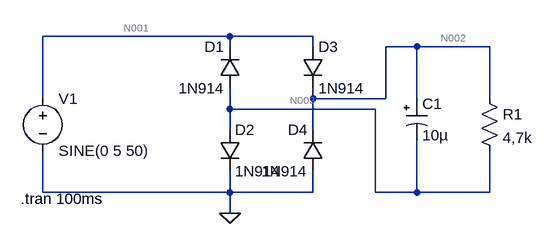
[diagram p0: schematic sim2shema.asc]
sim2shema.asc, the LTspice schematic file:
Version 4
SHEET 1 880 680
WIRE 288 64 0 64
WIRE 416 64 288 64
WIRE 288 80 288 64
WIRE 416 80 416 64
WIRE 576 80 528 80
WIRE 688 80 576 80
WIRE 0 160 0 64
WIRE 416 160 416 144
WIRE 528 160 528 80
WIRE 528 160 416 160
WIRE 576 160 576 80
WIRE 688 160 688 80
WIRE 288 176 288 144
WIRE 512 176 288 176
WIRE 288 208 288 176
WIRE 416 208 416 160
WIRE 0 304 0 240
WIRE 288 304 288 272
WIRE 288 304 0 304
WIRE 416 304 416 272
WIRE 416 304 288 304
WIRE 512 304 512 176
WIRE 576 304 576 224
WIRE 576 304 512 304
WIRE 688 304 688 240
WIRE 688 304 576 304
WIRE 288 336 288 304
FLAG 288 336 0
SYMBOL voltage 0 144 R0
WINDOW 123 0 0 Left 2
WINDOW 39 0 0 Left 2
SYMATTR InstName V1
SYMATTR Value SINE(0 5 50)
SYMBOL diode 304 144 R180
WINDOW 0 24 64 Left 2
WINDOW 3 24 0 Left 2
SYMATTR InstName D1
SYMATTR Value 1N914
SYMBOL diode 272 208 R0
SYMATTR InstName D2
SYMATTR Value 1N914
SYMBOL diode 400 80 R0
SYMATTR InstName D3
SYMATTR Value 1N914
SYMBOL diode 432 272 R180
WINDOW 0 24 64 Left 2
WINDOW 3 24 0 Left 2
SYMATTR InstName D4
SYMATTR Value 1N914
SYMBOL polcap 560 160 R0
WINDOW 3 24 56 Left 2
SYMATTR InstName C1
SYMATTR Value 10µ
SYMATTR Description Capacitor
SYMATTR Type cap
SYMBOL res 672 144 R0
SYMATTR InstName R1
SYMATTR Value 4,7k
TEXT -34 314 Left 2 !.tran 100ms

The netlist it stands for:
* sim2shema.asc
V1 N001 0 SINE(0 5 50)
D1 N003 N001 1N914
D2 N003 0 1N914
D3 N001 N002 1N914
D4 0 N002 1N914
C1 N002 N003 10µ
R1 N002 N003 4,7k
.model D D
.lib standard.dio
.tran 100ms
.backanno
.end

* Results of the author's LTspice run, read from the files saved beside the schematic
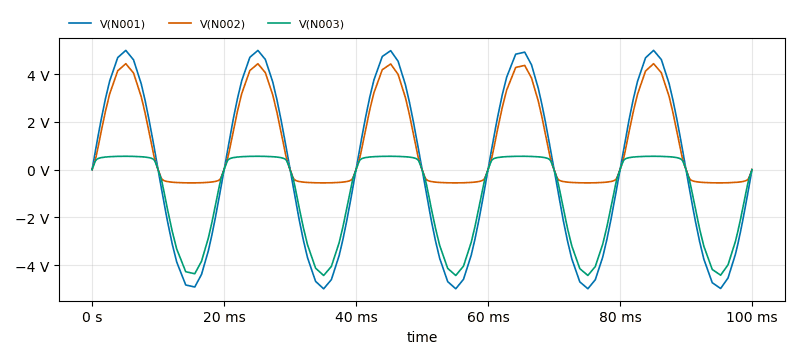
[diagram p1: Transient Analysis of sim2shema.asc, plotted from the saved traces]
* Transient Analysis, 1 run:
*   V(N001): min -4.997 V, max 4.997 V, average -62.67 µV, rms 3.509 V, last 0 V
*   V(N002): min -557.8 mV, max 4.439 V, average 1.086 V, rms 2.173 V, last 0 V
*   V(N003): min -4.439 V, max 557.8 mV, average -1.086 V, rms 2.173 V, last 0 V